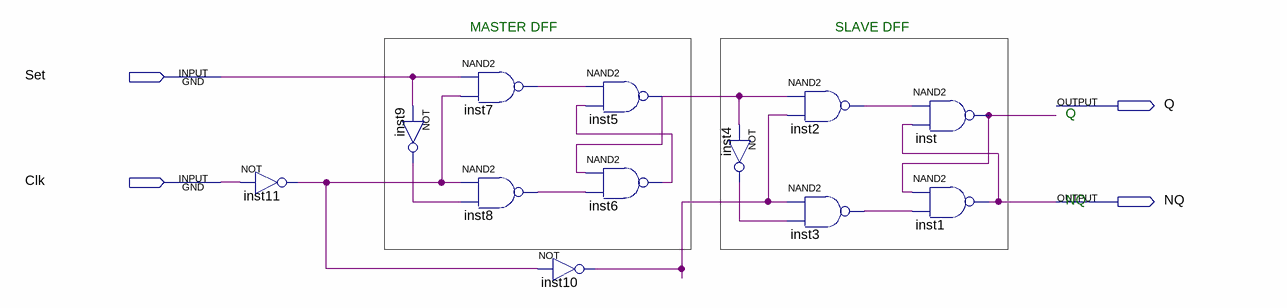
[diagram p0: schematic sheet]
// Quartus schematic MS_D_FlipFlop.bdf as structural Verilog: 12 symbols, 4 pins
module MS_D_FlipFlop (
  input  Set,
  input  Clk,
  output Q,
  output NQ
);

  wire inst2_out, inst3_out, inst4_out, inst5_out, inst6_out, inst7_out, inst8_out, inst9_out, inst10_out,
       inst11_out, inst_out;

  not inst11 (inst11_out, Clk);
  not inst9 (inst9_out, Set);
  nand inst7 (inst7_out, Set, inst11_out);
  nand inst8 (inst8_out, inst11_out, inst9_out);
  nand inst5 (inst5_out, inst7_out, inst6_out);
  nand inst6 (inst6_out, inst5_out, inst8_out);
  not inst10 (inst10_out, inst11_out);
  not inst4 (inst4_out, inst5_out);
  nand inst2 (inst2_out, inst5_out, inst10_out);
  nand inst3 (inst3_out, inst10_out, inst4_out);
  nand inst (inst_out, inst2_out, NQ);
  nand inst1 (NQ, inst_out, inst3_out);

  // Notes on the sheet:
  //   MASTER DFF
  //   SLAVE DFF
  //   Q
  //   NQ
endmodule
